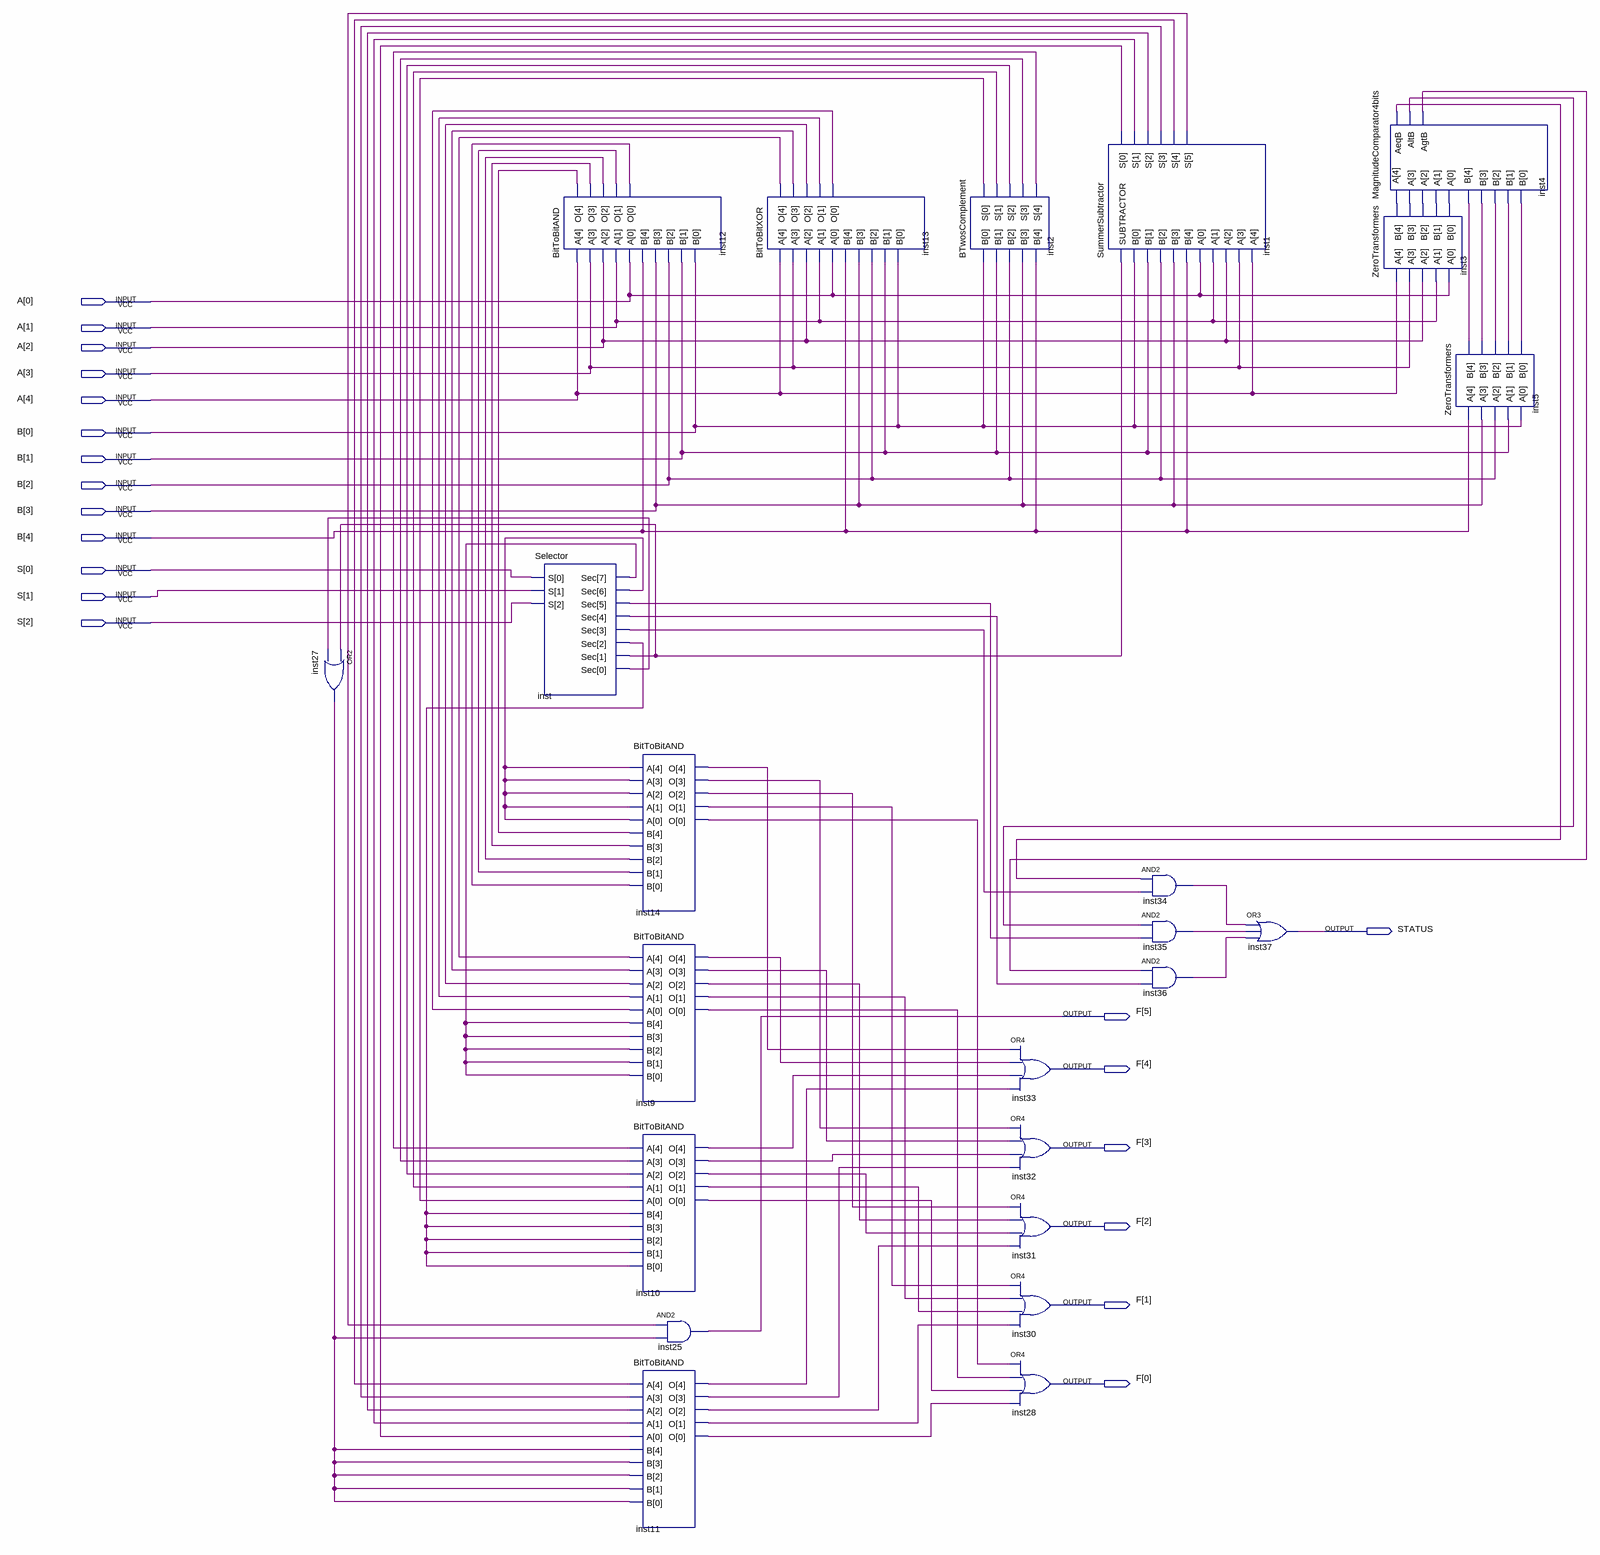
[diagram p0: schematic sheet]
// Quartus schematic ALU.bdf as structural Verilog: 23 symbols, 20 pins
module ALU (
  input  [4:0] A,
  input  [4:0] B,
  input  [2:0] S,
  output STATUS,
  output [5:0] F
);

  wire inst1_s, inst1_s_2, inst1_s_3, inst1_s_4, inst1_s_5, inst1_s_6, inst2_s, inst2_s_2, inst2_s_3,
       inst2_s_4, inst2_s_5, inst3_b, inst3_b_2, inst3_b_3, inst3_b_4, inst3_b_5, inst4_aeqb, inst4_agtb,
       inst4_altb, inst5_b, inst5_b_2, inst5_b_3, inst5_b_4, inst5_b_5, inst9_o, inst9_o_2, inst9_o_3,
       inst9_o_4, inst9_o_5, inst10_o, inst10_o_2, inst10_o_3, inst10_o_4, inst10_o_5, inst11_o, inst11_o_2,
       inst11_o_3, inst11_o_4, inst11_o_5, inst12_o, inst12_o_2, inst12_o_3, inst12_o_4, inst12_o_5,
       inst13_o, inst13_o_2, inst13_o_3, inst13_o_4, inst13_o_5, inst14_o, inst14_o_2, inst14_o_3,
       inst14_o_4, inst14_o_5, inst27_out, inst34_out, inst35_out, inst36_out, inst_sec, inst_sec_2,
       inst_sec_3, inst_sec_4, inst_sec_5, inst_sec_6, inst_sec_7, inst_sec_8;

  or inst27 (inst27_out, inst_sec_8, inst_sec_4);
  BitToBitAND inst12 (.A(A), .B(B), .O({inst12_o_5, inst12_o_2, inst12_o, inst12_o_3, inst12_o_4}));
  Selector inst (
    .S(S),
    .Sec({inst_sec_2, inst_sec, inst_sec_6, inst_sec_7, inst_sec_5, inst_sec_3, inst_sec_8, inst_sec_4}));
  BitToBitAND inst14 (
    .A({5{inst_sec}}), .B({inst12_o_5, inst12_o_2, inst12_o, inst12_o_3, inst12_o_4}),
    .O({inst14_o_5, inst14_o_4, inst14_o_3, inst14_o_2, inst14_o}));
  BitToBitAND inst9 (
    .A({inst13_o, inst13_o_2, inst13_o_3, inst13_o_4, inst13_o_5}), .B({5{inst_sec_2}}),
    .O({inst9_o_4, inst9_o_3, inst9_o_2, inst9_o, inst9_o_5}));
  BitToBitAND inst10 (
    .A({inst2_s_5, inst2_s_4, inst2_s_3, inst2_s_2, inst2_s}), .B({5{inst_sec_3}}),
    .O({inst10_o_5, inst10_o_4, inst10_o_3, inst10_o_2, inst10_o}));
  and inst25 (F[5], inst1_s_6, inst27_out);
  BitToBitAND inst11 (
    .A({inst1_s_5, inst1_s_4, inst1_s_3, inst1_s_2, inst1_s}), .B({5{inst27_out}}),
    .O({inst11_o_4, inst11_o_3, inst11_o_2, inst11_o, inst11_o_5}));
  BitToBitXOR inst13 (.A(A), .B(B), .O({inst13_o, inst13_o_2, inst13_o_3, inst13_o_4, inst13_o_5}));
  BTwosComplement inst2 (.B(B), .S({inst2_s_5, inst2_s_4, inst2_s_3, inst2_s_2, inst2_s}));
  or inst33 (F[4], inst14_o_5, inst9_o_4, inst10_o_5, inst11_o_4);
  or inst32 (F[3], inst14_o_4, inst9_o_3, inst10_o_4, inst11_o_3);
  or inst31 (F[2], inst14_o_3, inst9_o_2, inst10_o_3, inst11_o_2);
  or inst30 (F[1], inst14_o_2, inst9_o, inst10_o_2, inst11_o);
  or inst28 (F[0], inst14_o, inst9_o_5, inst10_o, inst11_o_5);
  SummerSubtractor inst1 (
    .SUBTRACTOR(inst_sec_8), .B(B), .A(A),
    .S({inst1_s_6, inst1_s_5, inst1_s_4, inst1_s_3, inst1_s_2, inst1_s}));
  and inst34 (inst34_out, inst4_aeqb, inst_sec_5);
  and inst35 (inst35_out, inst4_altb, inst_sec_6);
  and inst36 (inst36_out, inst4_agtb, inst_sec_7);
  or inst37 (STATUS, inst34_out, inst35_out, inst36_out);
  MagnitudeComparator4bits inst4 (
    .A({inst3_b, inst3_b_2, inst3_b_3, inst3_b_4, inst3_b_5}),
    .B({inst5_b, inst5_b_2, inst5_b_3, inst5_b_4, inst5_b_5}), .AeqB(inst4_aeqb), .AltB(inst4_altb),
    .AgtB(inst4_agtb));
  ZeroTransformers inst3 (.A(A), .B({inst3_b, inst3_b_2, inst3_b_3, inst3_b_4, inst3_b_5}));
  ZeroTransformers inst5 (.A(B), .B({inst5_b, inst5_b_2, inst5_b_3, inst5_b_4, inst5_b_5}));
endmodule
